# EAGLE design Nixie Clock V4 (EAGLE 9.6.2)

## Sheet 1 of 2: Control board
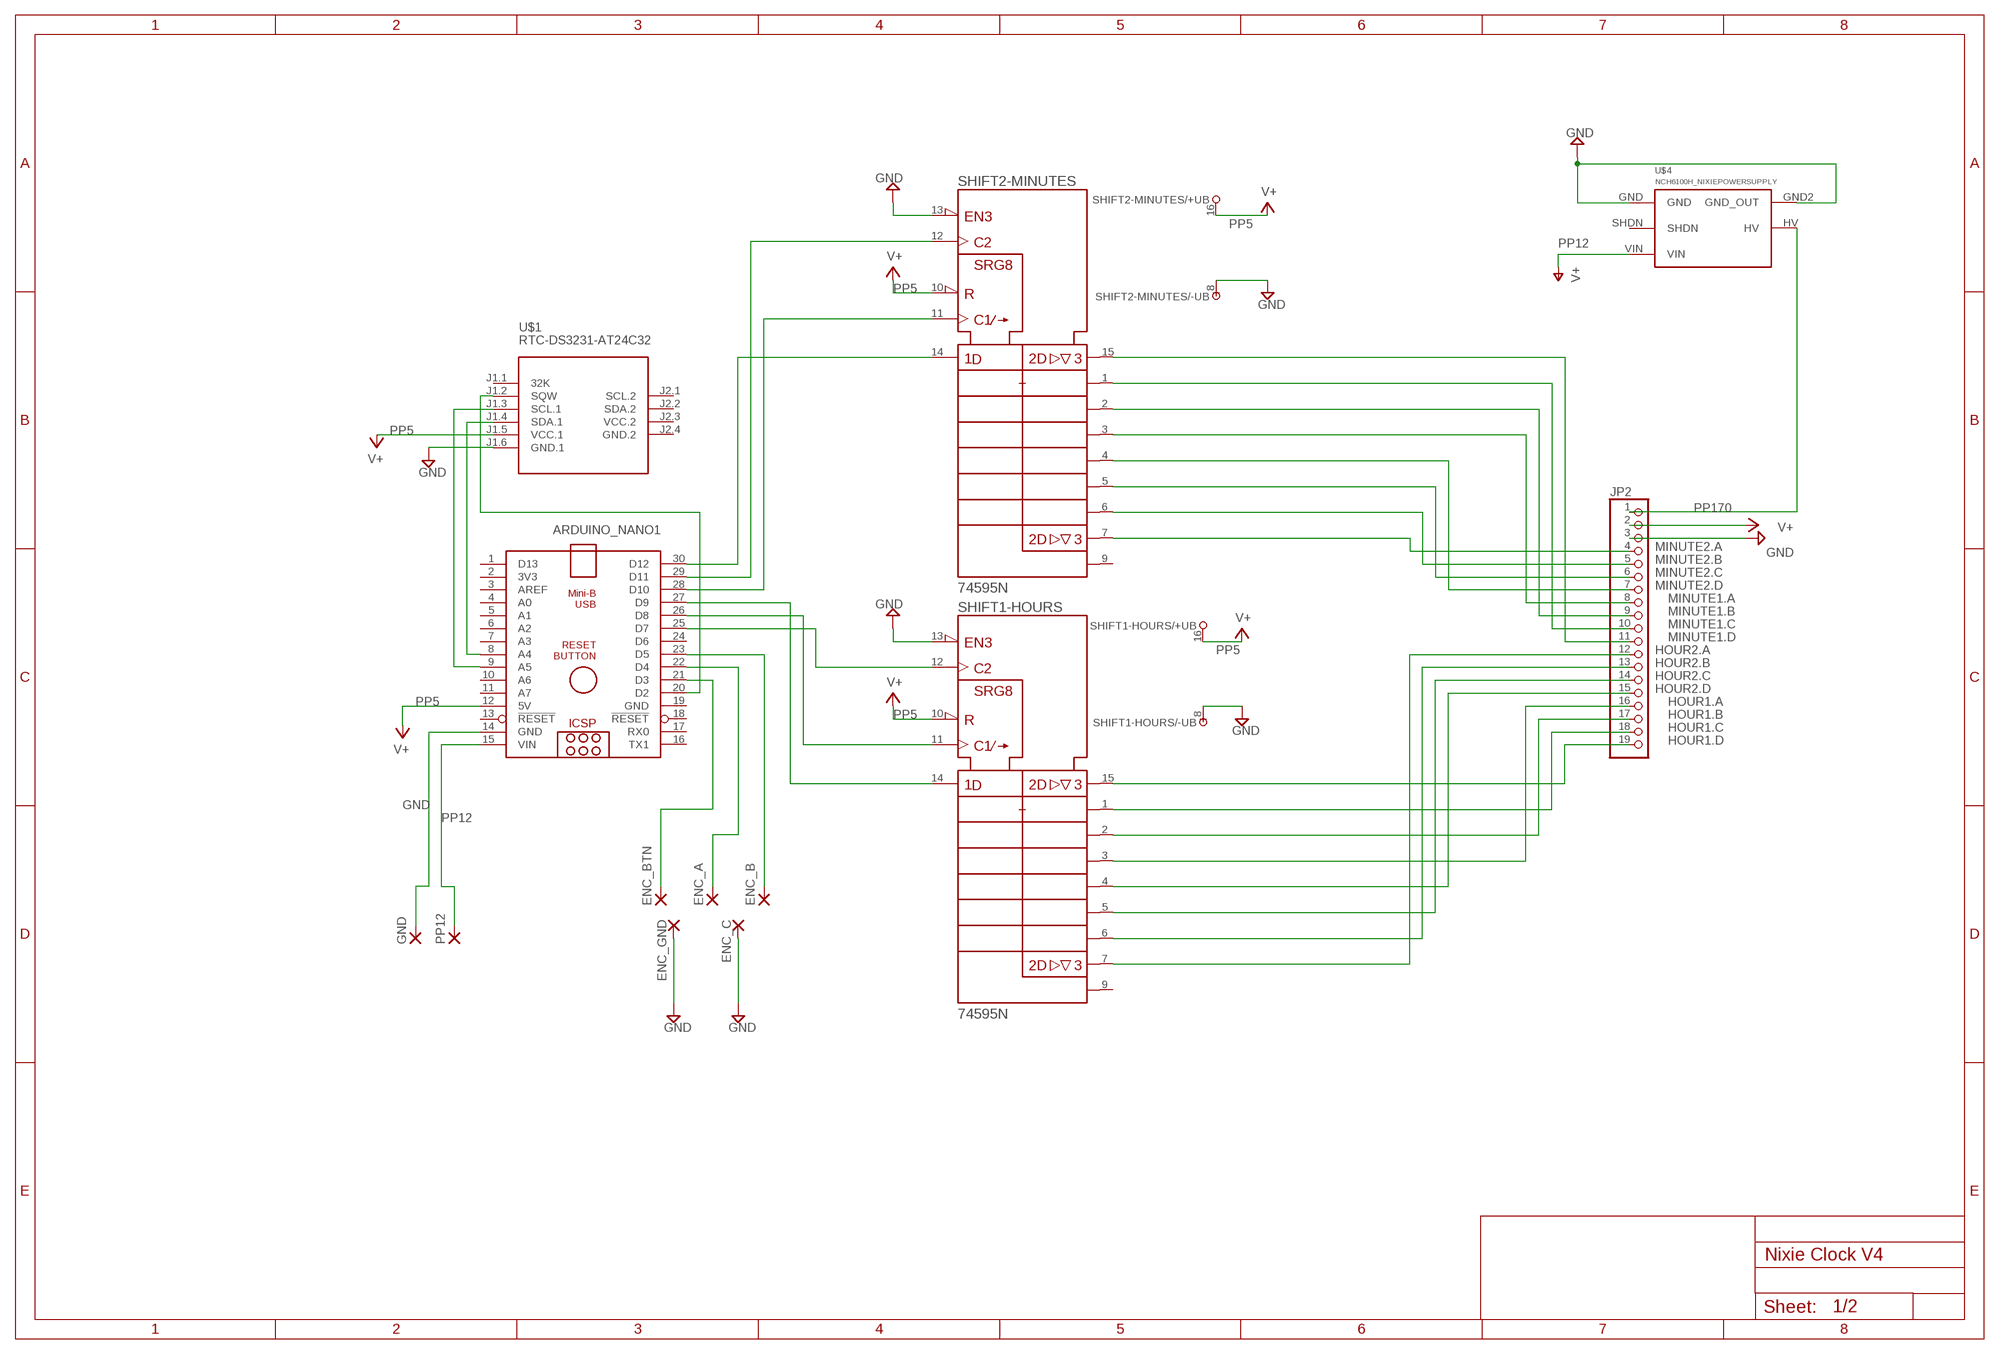
[diagram p0: schematic, sheet 1]

### Parts
ARDUINO_NANO1  ARDUINO_NANO  [ARDUINO_NANO]
ENC_A  2,54/1,0  [2,54/1,0]
ENC_B  2,54/1,0  [2,54/1,0]
ENC_BTN  2,54/1,0  [2,54/1,0]
ENC_C  2,54/1,0  [2,54/1,0]
ENC_GND  2,54/1,0  [2,54/1,0]
GND  2,54/1,0  [2,54/1,0]
JP2  PINHD-1X19  [1X19]
PP12  2,54/1,0  [2,54/1,0]
SHIFT1-HOURS  74595N  [DIL16]
SHIFT2-MINUTES  74595N  [DIL16]
U$1  RTC-DS3231-AT24C32  [RTC-DS3231-AT24C32]
U$4  NCH6100H_NIXIEPOWERSUPPLY  [NCH6100HV_NIXIEPOWERSUPPLY]

### Nets
GND: ARDUINO_NANO1.14(GND) ENC_C.1(P) ENC_GND.1(P) GND.1(P) JP2.3 SHIFT1-HOURS.8(-UB) SHIFT1-HOURS.13(!G) SHIFT2-MINUTES.8(-UB) SHIFT2-MINUTES.13(!G) U$1.J1.6(GND.1) U$4.GND U$4.GND2(GND_OUT)
HOUR1.A: JP2.16 SHIFT1-HOURS.3(QD)
HOUR1.B: JP2.17 SHIFT1-HOURS.2(QC)
HOUR1.C: JP2.18 SHIFT1-HOURS.1(QB)
HOUR1.D: JP2.19 SHIFT1-HOURS.15(QA)
HOUR2.A: JP2.12 SHIFT1-HOURS.7(QH)
HOUR2.B: JP2.13 SHIFT1-HOURS.6(QG)
HOUR2.C: JP2.14 SHIFT1-HOURS.5(QF)
HOUR2.D: JP2.15 SHIFT1-HOURS.4(QE)
MINUTE1.A: JP2.8 SHIFT2-MINUTES.3(QD)
MINUTE1.B: JP2.9 SHIFT2-MINUTES.2(QC)
MINUTE1.C: JP2.10 SHIFT2-MINUTES.1(QB)
MINUTE1.D: JP2.11 SHIFT2-MINUTES.15(QA)
MINUTE2.A: JP2.4 SHIFT2-MINUTES.7(QH)
MINUTE2.B: JP2.5 SHIFT2-MINUTES.6(QG)
MINUTE2.C: JP2.6 SHIFT2-MINUTES.5(QF)
MINUTE2.D: JP2.7 SHIFT2-MINUTES.4(QE)
N$1: ARDUINO_NANO1.8(A4) U$1.J1.4(SDA.1)
N$2: ARDUINO_NANO1.9(A5) U$1.J1.3(SCL.1)
N$3: ARDUINO_NANO1.30(D12) SHIFT2-MINUTES.14(SER)
N$4: ARDUINO_NANO1.29(D11) SHIFT2-MINUTES.12(RCK)
N$5: ARDUINO_NANO1.28(D10) SHIFT2-MINUTES.11(SRCK)
N$6: ARDUINO_NANO1.22(D4) ENC_A.1(P)
N$7: ARDUINO_NANO1.26(D8) SHIFT1-HOURS.11(SRCK)
N$8: ARDUINO_NANO1.25(D7) SHIFT1-HOURS.12(RCK)
N$26: ARDUINO_NANO1.23(D5) ENC_B.1(P)
N$27: ARDUINO_NANO1.21(D3) ENC_BTN.1(P)
N$63: ARDUINO_NANO1.20(D2) U$1.J1.2(SQW)
PP5: ARDUINO_NANO1.12(5V) JP2.2 SHIFT1-HOURS.10(!SRCLR) SHIFT1-HOURS.16(+UB) SHIFT2-MINUTES.10(!SRCLR) SHIFT2-MINUTES.16(+UB) U$1.J1.5(VCC.1) ; supply symbol labelled V+
PP12: ARDUINO_NANO1.15(VIN) PP12.1(P) U$4.VIN ; supply symbol labelled V+
PP170: JP2.1 U$4.HV
SERIAL-IN: ARDUINO_NANO1.27(D9) SHIFT1-HOURS.14(SER)
Unconnected: ARDUINO_NANO1.1(D13) ARDUINO_NANO1.2(3V3) ARDUINO_NANO1.3(AREF) ARDUINO_NANO1.4(A0) ARDUINO_NANO1.5(A1) ARDUINO_NANO1.6(A2) ARDUINO_NANO1.7(A3) ARDUINO_NANO1.10(A6) ARDUINO_NANO1.11(A7) ARDUINO_NANO1.13(!RESET) ARDUINO_NANO1.16(TX1) ARDUINO_NANO1.17(RX0) ARDUINO_NANO1.18(!RESET) ARDUINO_NANO1.24(D6) SHIFT1-HOURS.9(QH*) SHIFT2-MINUTES.9(QH*) U$1.J1.1(32K) U$1.J2.1(SCL.2) U$1.J2.2(SDA.2) U$4.SHDN

## Sheet 2 of 2: Display board
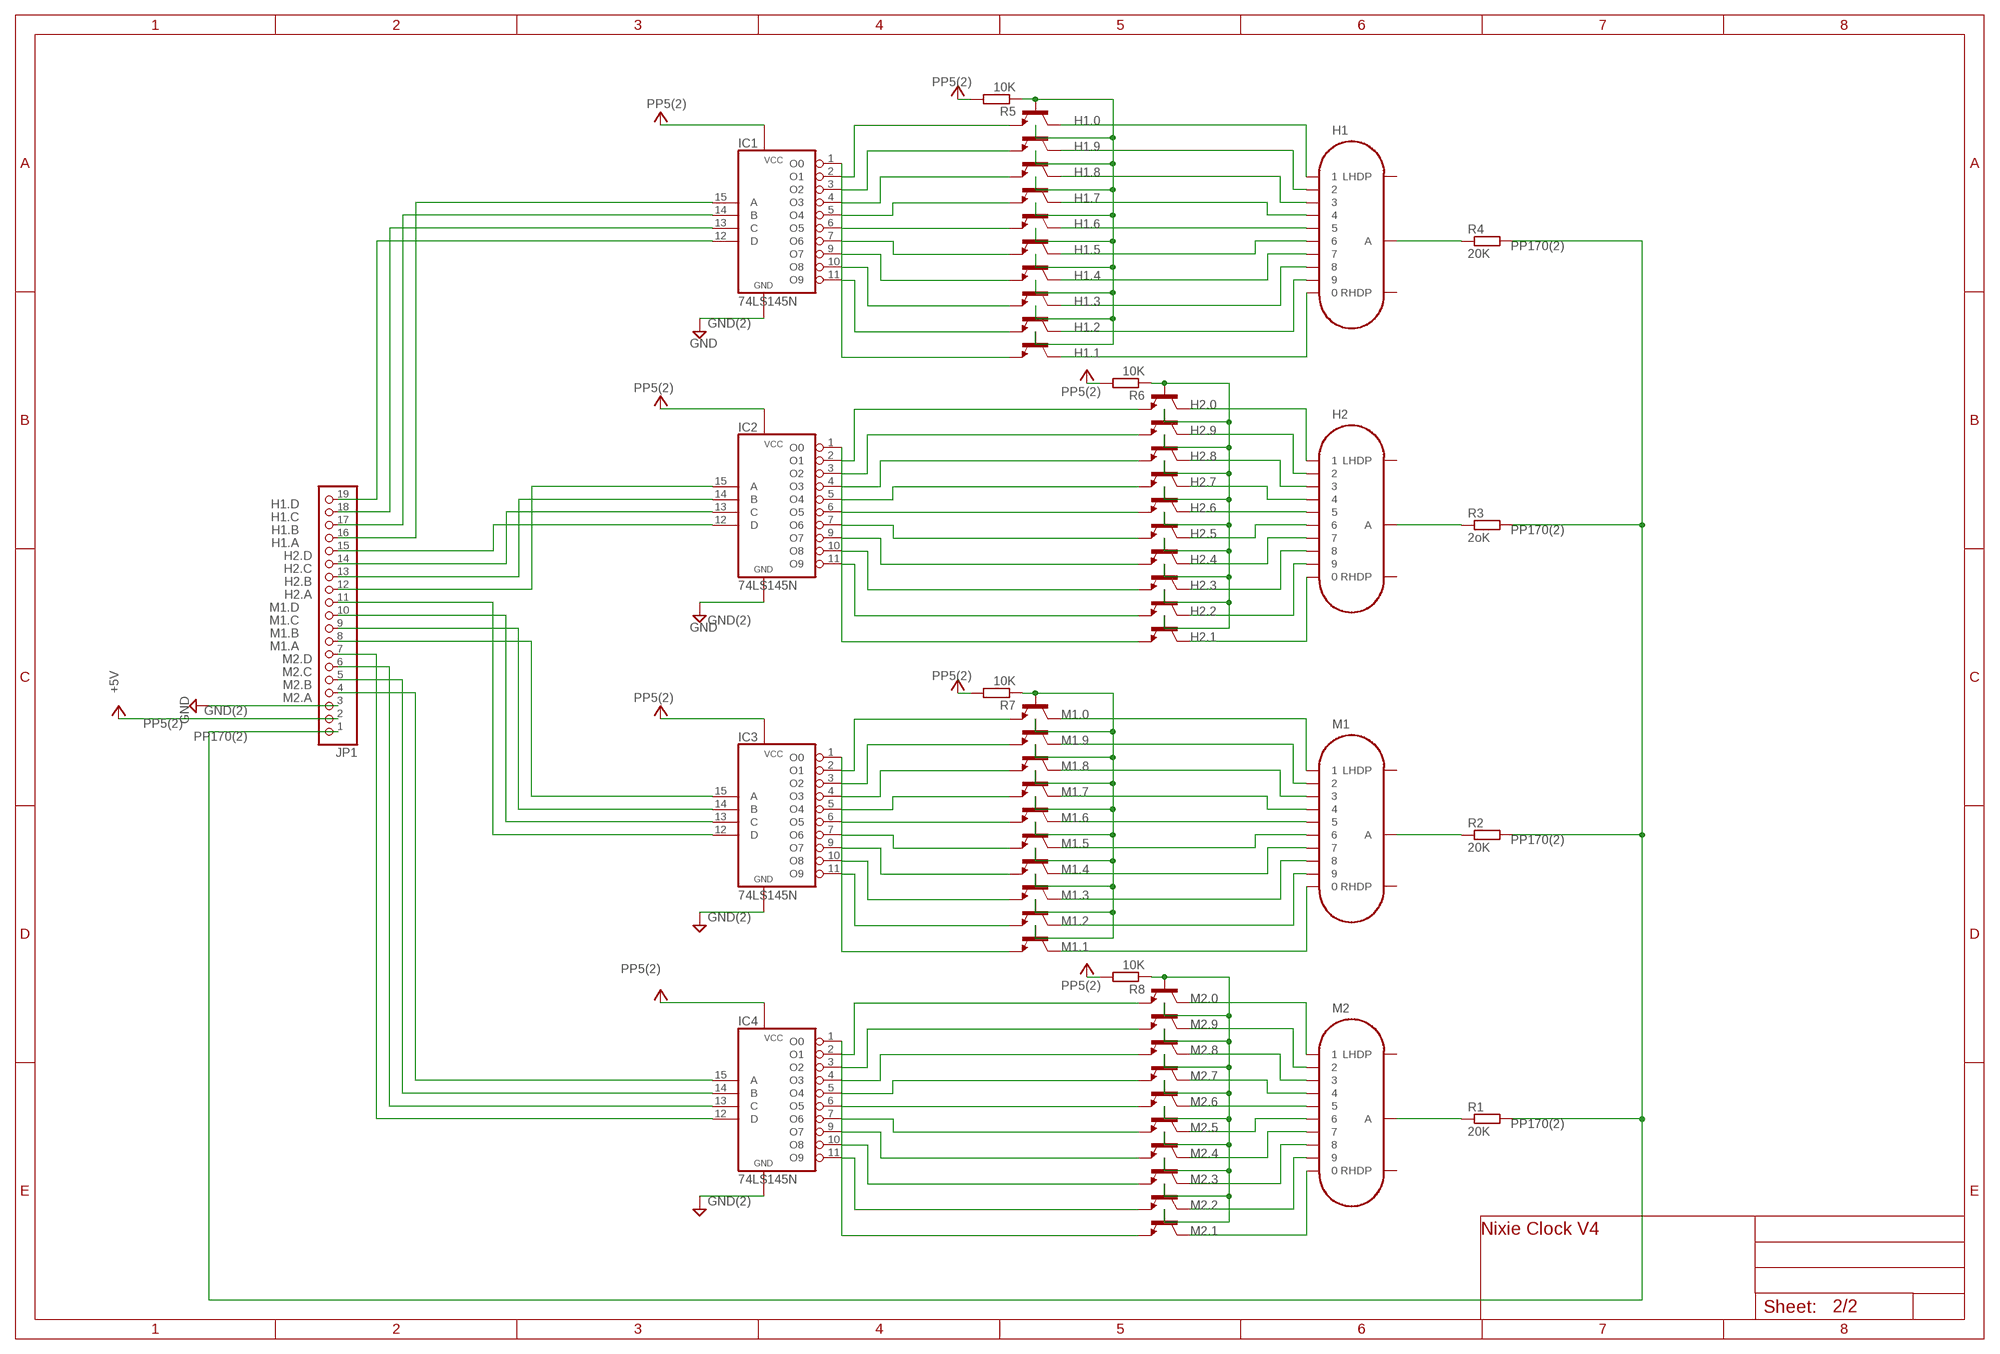
[diagram p1: schematic, sheet 2]

### Parts
H1  IN-14  [IN-14]
H1.0  MPSA42-NPN-TO92-EBC  [TO92-EBC]
H1.1  MPSA42-NPN-TO92-EBC  [TO92-EBC]
H1.2  MPSA42-NPN-TO92-EBC  [TO92-EBC]
H1.3  MPSA42-NPN-TO92-EBC  [TO92-EBC]
H1.4  MPSA42-NPN-TO92-EBC  [TO92-EBC]
H1.5  MPSA42-NPN-TO92-EBC  [TO92-EBC]
H1.6  MPSA42-NPN-TO92-EBC  [TO92-EBC]
H1.7  MPSA42-NPN-TO92-EBC  [TO92-EBC]
H1.8  MPSA42-NPN-TO92-EBC  [TO92-EBC]
H1.9  MPSA42-NPN-TO92-EBC  [TO92-EBC]
H2  IN-14  [IN-14]
H2.0  MPSA42-NPN-TO92-EBC  [TO92-EBC]
H2.1  MPSA42-NPN-TO92-EBC  [TO92-EBC]
H2.2  MPSA42-NPN-TO92-EBC  [TO92-EBC]
H2.3  MPSA42-NPN-TO92-EBC  [TO92-EBC]
H2.4  MPSA42-NPN-TO92-EBC  [TO92-EBC]
H2.5  MPSA42-NPN-TO92-EBC  [TO92-EBC]
H2.6  MPSA42-NPN-TO92-EBC  [TO92-EBC]
H2.7  MPSA42-NPN-TO92-EBC  [TO92-EBC]
H2.8  MPSA42-NPN-TO92-EBC  [TO92-EBC]
H2.9  MPSA42-NPN-TO92-EBC  [TO92-EBC]
IC1  74LS145N  [DIL16]
IC2  74LS145N  [DIL16]
IC3  74LS145N  [DIL16]
IC4  74LS145N  [DIL16]
JP1  PINHD-1X19  [1X19]
M1  IN-14  [IN-14]
M1.0  MPSA42-NPN-TO92-EBC  [TO92-EBC]
M1.1  MPSA42-NPN-TO92-EBC  [TO92-EBC]
M1.2  MPSA42-NPN-TO92-EBC  [TO92-EBC]
M1.3  MPSA42-NPN-TO92-EBC  [TO92-EBC]
M1.4  MPSA42-NPN-TO92-EBC  [TO92-EBC]
M1.5  MPSA42-NPN-TO92-EBC  [TO92-EBC]
M1.6  MPSA42-NPN-TO92-EBC  [TO92-EBC]
M1.7  MPSA42-NPN-TO92-EBC  [TO92-EBC]
M1.8  MPSA42-NPN-TO92-EBC  [TO92-EBC]
M1.9  MPSA42-NPN-TO92-EBC  [TO92-EBC]
M2  IN-14  [IN-14]
M2.0  MPSA42-NPN-TO92-EBC  [TO92-EBC]
M2.1  MPSA42-NPN-TO92-EBC  [TO92-EBC]
M2.2  MPSA42-NPN-TO92-EBC  [TO92-EBC]
M2.3  MPSA42-NPN-TO92-EBC  [TO92-EBC]
M2.4  MPSA42-NPN-TO92-EBC  [TO92-EBC]
M2.5  MPSA42-NPN-TO92-EBC  [TO92-EBC]
M2.6  MPSA42-NPN-TO92-EBC  [TO92-EBC]
M2.7  MPSA42-NPN-TO92-EBC  [TO92-EBC]
M2.8  MPSA42-NPN-TO92-EBC  [TO92-EBC]
M2.9  MPSA42-NPN-TO92-EBC  [TO92-EBC]
R1  20K  R-EU_0411/12  [0411/12]
R2  20K  R-EU_0411/12  [0411/12]
R3  2oK  R-EU_0411/12  [0411/12]
R4  20K  R-EU_0411/12  [0411/12]
R5  10K  R-EU_0411/12  [0411/12]
R6  10K  R-EU_0411/12  [0411/12]
R7  10K  R-EU_0411/12  [0411/12]
R8  10K  R-EU_0411/12  [0411/12]

### Nets
GND(2): IC1.8(GND) IC2.8(GND) IC3.8(GND) IC4.8(GND) JP1.3 ; supply symbol labelled GND
H1.A: IC1.15(A) JP1.16
H1.B: IC1.14(B) JP1.17
H1.C: IC1.13(C) JP1.18
H1.D: IC1.12(D) JP1.19
H2.A: IC2.15(A) JP1.12
H2.B: IC2.14(B) JP1.13
H2.C: IC2.13(C) JP1.14
H2.D: IC2.12(D) JP1.15
M1.4: M1.0.B M1.1.B M1.2.B M1.3.B M1.4.B M1.5.B M1.6.B M1.7.B M1.8.B M1.9.B R7.1
M1.A: IC3.15(A) JP1.8
M1.B: IC3.14(B) JP1.9
M1.C: IC3.13(C) JP1.10
M1.D: IC3.12(D) JP1.11
M2.4: M2.0.B M2.1.B M2.2.B M2.3.B M2.4.B M2.5.B M2.6.B M2.7.B M2.8.B M2.9.B R8.1
M2.A: IC4.15(A) JP1.4
M2.B: IC4.14(B) JP1.5
M2.C: IC4.13(C) JP1.6
M2.D: IC4.12(D) JP1.7
N$9: H1.0.B H1.1.B H1.2.B H1.3.B H1.4.B H1.5.B H1.6.B H1.7.B H1.8.B H1.9.B R5.1
N$10: H2.0.B H2.1.B H2.2.B H2.3.B H2.4.B H2.5.B H2.6.B H2.7.B H2.8.B H2.9.B R6.1
N$11: M2.0.C M2.1
N$12: M2.2 M2.9.C
N$13: M2.3 M2.8.C
N$18: M2.4 M2.7.C
N$19: M2.0 M2.1.C
N$20: M2.2.C M2.9
N$21: M2.3.C M2.8
N$22: M2.4.C M2.7
N$23: M2.5.C M2.6
N$24: M2.5 M2.6.C
N$25: M1.5 M1.6.C
N$28: M1.0.C M1.1
N$29: M1.2 M1.9.C
N$30: M1.3 M1.8.C
N$31: M1.4 M1.7.C
N$32: M1.0 M1.1.C
N$33: M1.2.C M1.9
N$34: M1.3.C M1.8
N$35: M1.4.C M1.7
N$36: M1.5.C M1.6
N$37: H2.0 H2.1.C
N$38: H2.2.C H2.9
N$39: H2.3.C H2.8
N$40: H2.0.C H2.1
N$41: H2.2 H2.9.C
N$42: H2.3 H2.8.C
N$43: H2.4.C H2.7
N$44: H2.5.C H2.6
N$45: H2.4 H2.7.C
N$46: H2.5 H2.6.C
N$47: H1.0.C H1.1
N$48: H1.2 H1.9.C
N$49: H1.3 H1.8.C
N$50: H1.4 H1.7.C
N$51: H1.5 H1.6.C
N$52: H1.0 H1.1.C
N$53: H1.2.C H1.9
N$54: H1.3.C H1.8
N$55: H1.4.C H1.7
N$56: H1.5.C H1.6
N$57: IC4.2(O1) M2.0.E
N$58: IC4.3(O2) M2.9.E
N$59: IC4.4(O3) M2.8.E
N$60: IC4.5(O4) M2.7.E
N$61: IC4.6(O5) M2.6.E
N$62: IC4.7(O6) M2.5.E
N$64: IC4.9(O7) M2.4.E
N$65: IC4.10(O8) M2.3.E
N$66: IC4.11(O9) M2.2.E
N$67: IC4.1(O0) M2.1.E
N$68: IC3.6(O5) M1.6.E
N$69: H1.6.E IC1.6(O5)
N$70: H2.6.E IC2.6(O5)
N$71: M2.A R1.1
N$72: M1.A R2.1
N$73: H2.A R3.1
N$74: H1.A R4.1
N$75: IC3.2(O1) M1.0.E
N$76: IC3.3(O2) M1.9.E
N$77: IC3.4(O3) M1.8.E
N$78: IC3.5(O4) M1.7.E
N$79: IC3.7(O6) M1.5.E
N$80: IC3.9(O7) M1.4.E
N$81: IC3.10(O8) M1.3.E
N$82: IC3.11(O9) M1.2.E
N$83: IC3.1(O0) M1.1.E
N$84: H2.0.E IC2.2(O1)
N$85: H2.9.E IC2.3(O2)
N$86: H2.8.E IC2.4(O3)
N$87: H2.7.E IC2.5(O4)
N$88: H2.5.E IC2.7(O6)
N$89: H2.4.E IC2.9(O7)
N$90: H2.3.E IC2.10(O8)
N$91: H2.2.E IC2.11(O9)
N$92: H2.1.E IC2.1(O0)
N$93: H1.0.E IC1.2(O1)
N$94: H1.9.E IC1.3(O2)
N$95: H1.8.E IC1.4(O3)
N$96: H1.7.E IC1.5(O4)
N$97: H1.5.E IC1.7(O6)
N$98: H1.4.E IC1.9(O7)
N$99: H1.3.E IC1.10(O8)
N$100: H1.2.E IC1.11(O9)
N$101: H1.1.E IC1.1(O0)
PP5(2): IC1.16(VCC) IC2.16(VCC) IC3.16(VCC) IC4.16(VCC) JP1.2 R5.2 R6.2 R7.2 R8.2 ; supply symbol labelled +5V
PP170(2): JP1.1 R1.2 R2.2 R3.2 R4.2
Unconnected: H1.LHDP H1.RHDP H2.LHDP H2.RHDP M1.LHDP M1.RHDP M2.LHDP M2.RHDP

## Power pins joined to a net without a drawn wire
GND: ARDUINO_NANO1.19(GND)
GND.2: U$1.J2.4(GND.2)
VCC.2: U$1.J2.3(VCC.2)

## Library data of the parts
ARDUINO_NANO1 = ArduinoNanoV30:ARDUINO_NANO: Arduino Nano V3.0 Overview: The Arduino Nano is a small, complete, and breadboard-friendly board based on the ATmega328 (Arduino Nano 3.x) or ATmega168 (Arduino Nano 2.x). It has more or less the same functionality of the Arduino Duemilanove, but in a different package. It lacks only a DC power jack, and works with a Mini-B USB cable instead of a standard one. The Nano was designed and is being produced by Gravitech. Specifications: Microcontroller Atmel ATmega168 or ATmega328 Operating Voltage (logic level) 5 V Input Voltage (recommended) 7-12 V Input Voltage (limits) 6-20 V Digital I/O Pins 14 (of which 6 provide PWM output) Analog Input Pins 8 DC Current per I/O Pin 40 mA Flash Memory 16 KB (ATmega168) or 32 KB (ATmega328) of which 2 KB used by bootloader SRAM 1 KB (ATmega168) or 2 KB (ATmega328) EEPROM 512 bytes (ATmega168) or 1 KB (ATmega328) Clock Speed 16 MHz Dimensions 0.73" x 1.70" Length 45 mm Width 18 mm Weigth 5 g Power: The Arduino Nano can be powered via the Mini-B USB connection, 6-20V unregulated external power supply (pin 30), or 5V regulated external power supply (pin 27). The power source is automatically selected to the highest voltage source. Memory: The ATmega168 has 16 KB of flash memory for storing code (of which 2 KB is used for the bootloader); the ATmega328 has 32 KB, (also with 2 KB used for the bootloader). The ATmega168 has 1 KB of SRAM and 512 bytes of EEPROM (which can be read and written with the EEPROM library); the ATmega328 has 2 KB of SRAM and 1 KB of EEPROM. Input and Output: Each of the 14 digital pins on the Nano can be used as an input or output, using pinMode(), digitalWrite(), and digitalRead() functions. They operate at 5 volts. Each pin can provide or receive a maximum of 40 mA and has an internal pull-up resistor (disconnected by default) of 20-50 kOhms. In addition, some pins have specialized functions. Visit Arduino - ArduinoBoardNano <https://www.arduino.cc/en/Main/ArduinoBoardNano>
ENC_A ENC_B ENC_BTN ENC_C ENC_GND GND PP12 = wirepad:2,54/1,0: THROUGH-HOLE PAD
H1 H2 M1 M2 = russian-nixies:IN-14: IN-14: medium numeric frontview nixie tube
H1.0 H1.1-H1.9 H2.0 H2.1-H2.9 M1.0 M1.1-M1.9 M2.0 M2.1-M2.9 = Joel Custom library:*-NPN-: NPN Transistror BF959 corrected 2008.03.06
IC1-IC4 = Joel Custom library:74*145: BCD to decimal DECODER/DRIVER
JP1 JP2 = pinhead:PINHD-1X19: PIN HEADER
R1-R8 = rcl:R-EU_: RESISTOR, European symbol; SPICEPREFIX: R
SHIFT1-HOURS SHIFT2-MINUTES = 74ttl-din:74*595: 8-bit SHIFT REGISTER, output latch
U$1 = diy-modules (1):RTC-DS3231-AT24C32: RTC Module with Battery and EEPROM based on DS3231 and AT24C32 chips Tutorial can be found here: https://edwardmallon.wordpress.com/2014/05/21/using-a-cheap-3-ds3231-rtc-at24c32-eeprom-from-ebay/ Click here to find device on ebay.com <http://www.ebay.com/sch/DS3231+AT24C32+module>
U$4 = Joel Custom library:NCH6100H_NIXIEPOWERSUPPLY

## Board
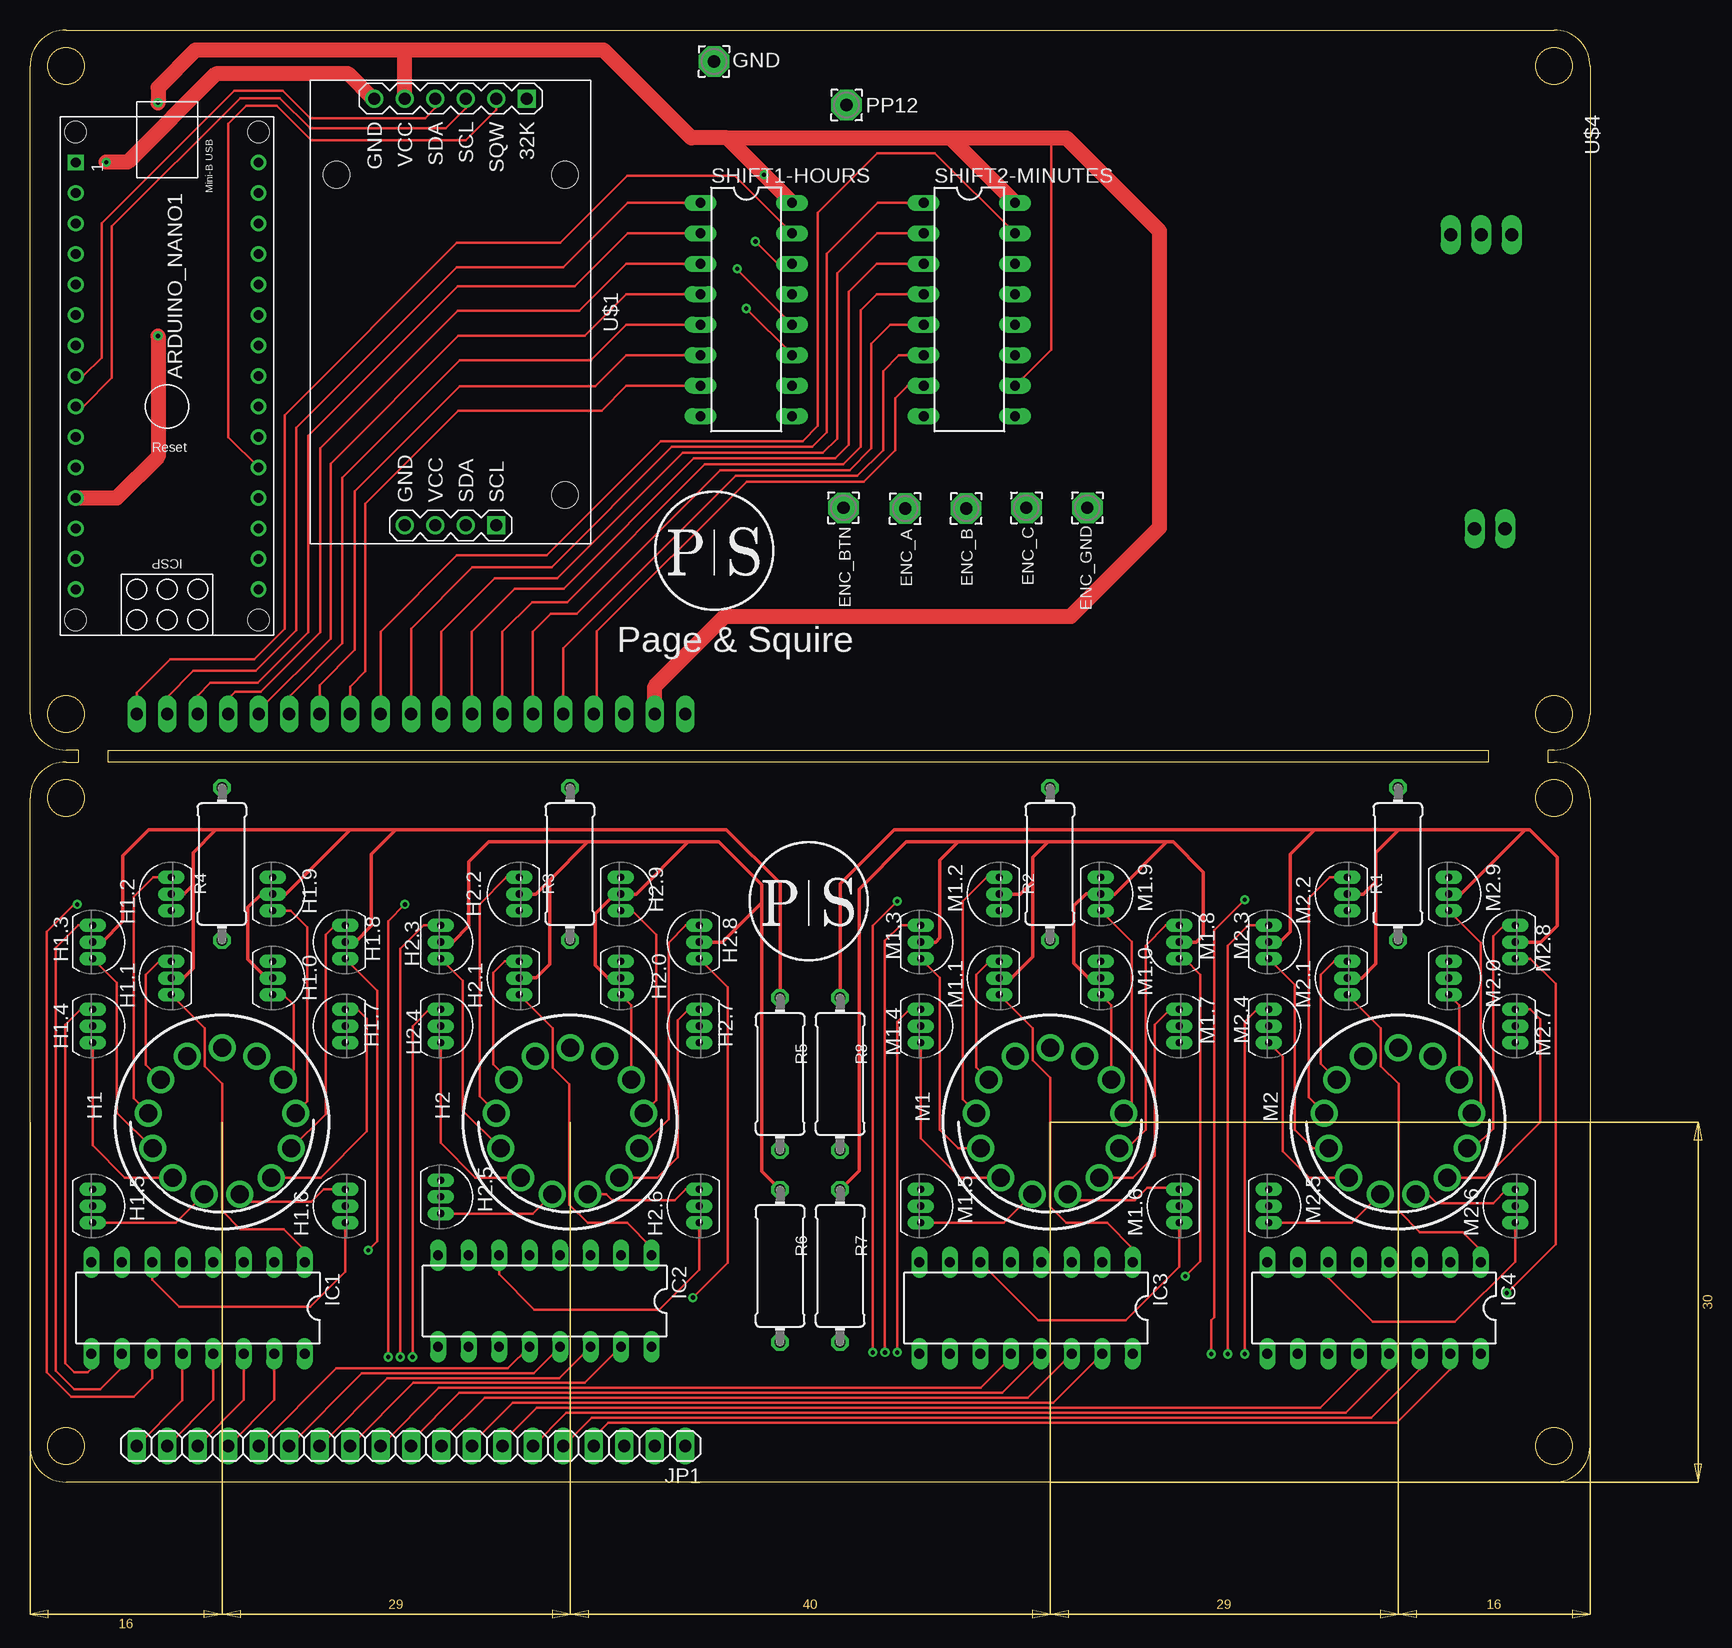
[diagram p2: board, top side]
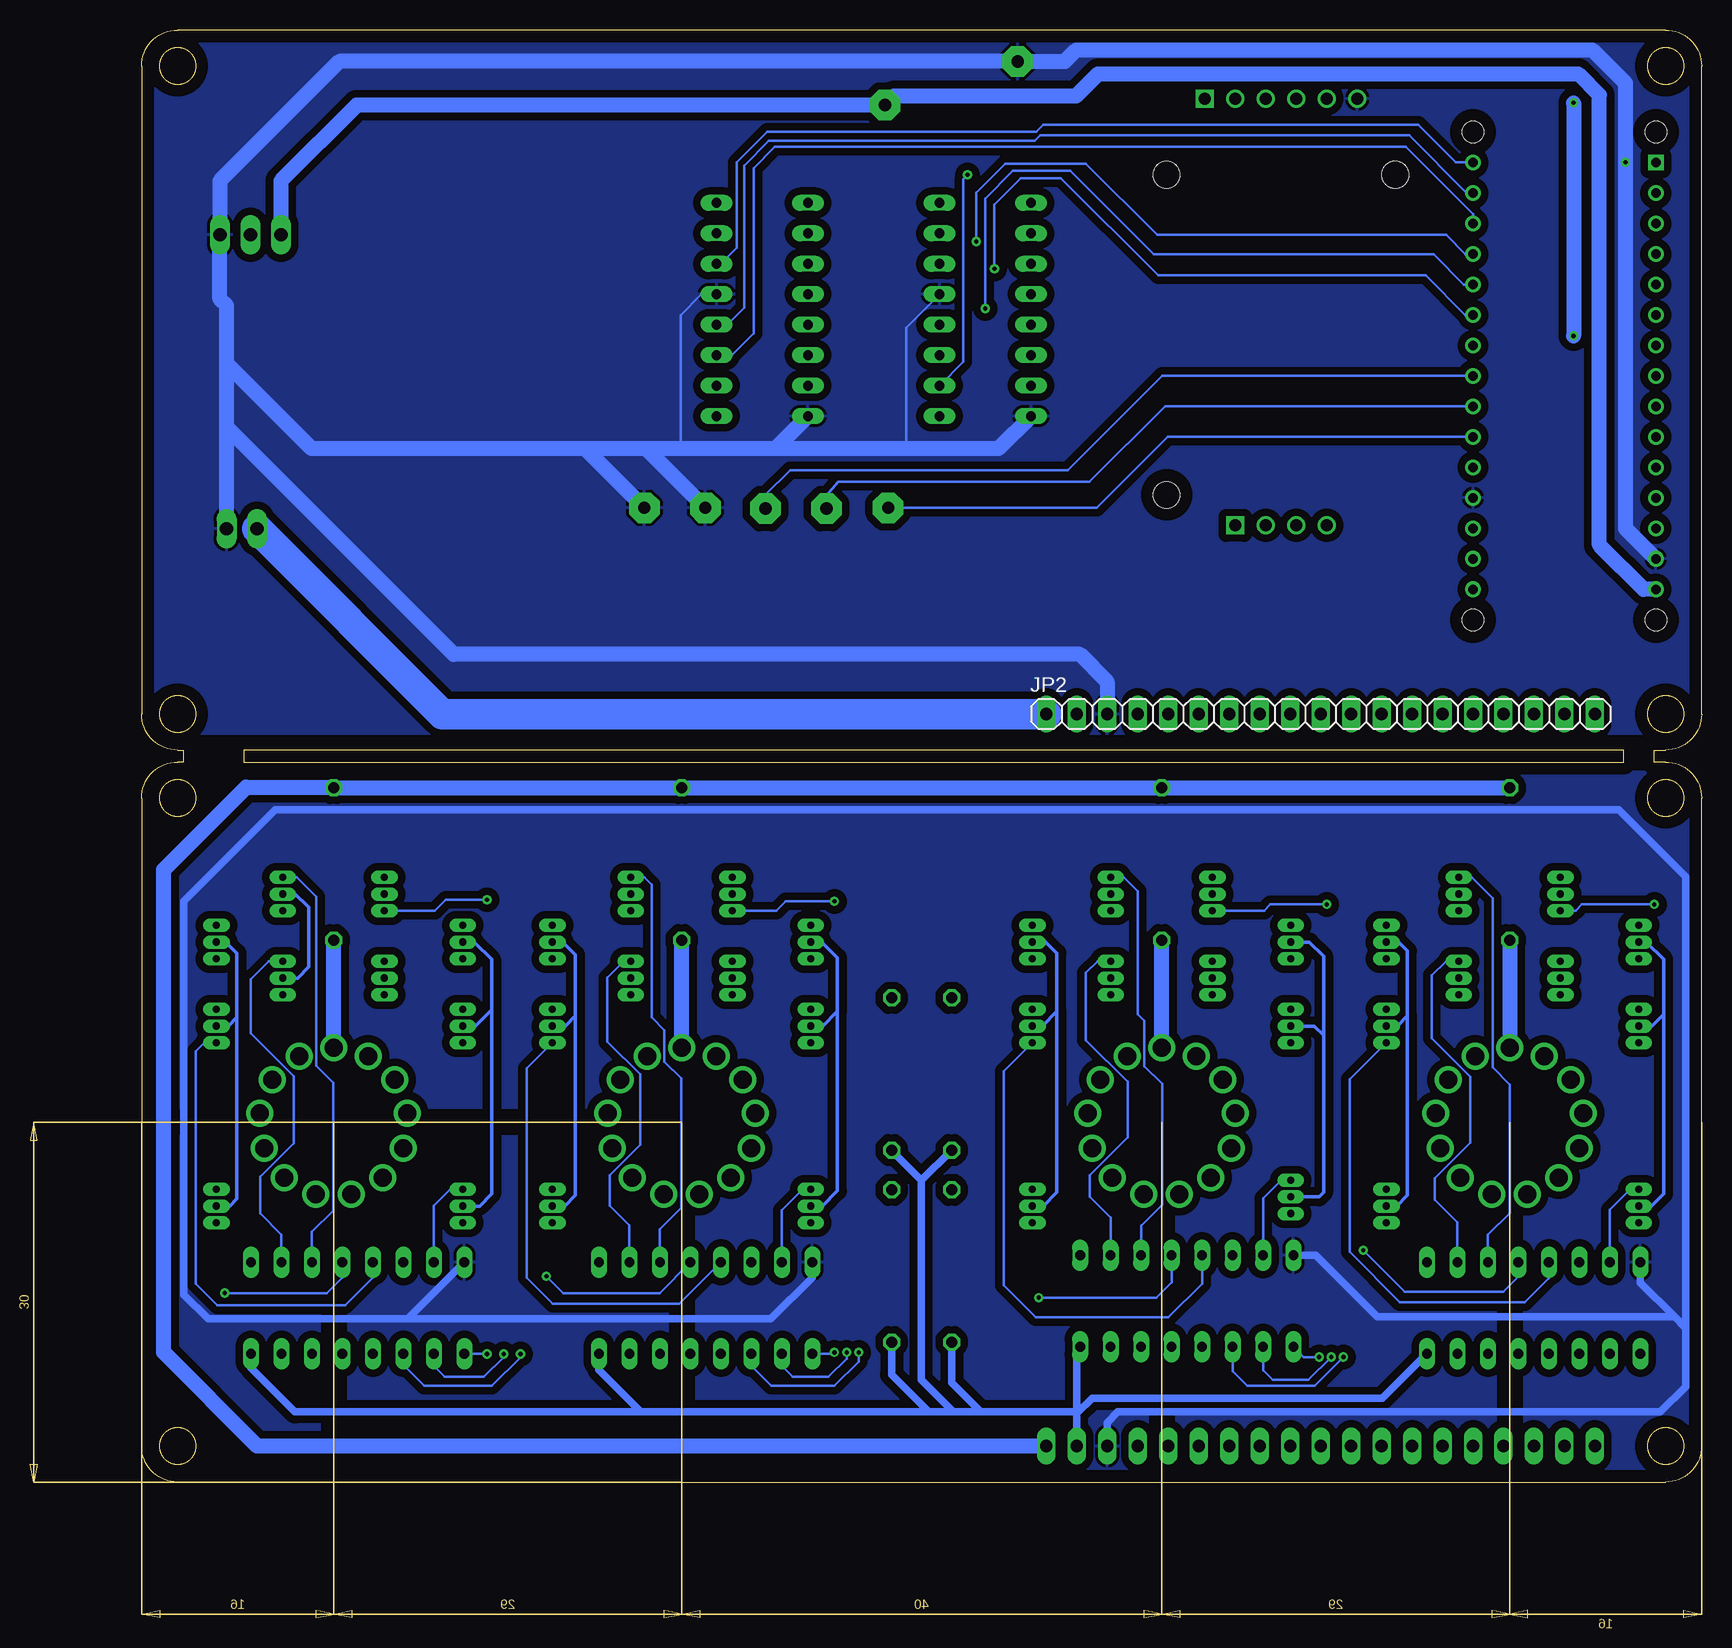
[diagram p3: board, bottom side, seen from below]

Size 130 x 121 mm. Coordinates in mm from the lower left corner, seen from the top.
Outline: 6.5,61 121.5,61 121.5,60 6.5,60 6.5,61
Outline: 130,118 arc90 127,121 3,121 arc90 0,118 0,64 arc90 3,61 4,61 4,60 3,60 arc90 0,57 0,3 arc90 3,0 127,0 arc90 130,3 130,57 arc90 127,60 126.5,60 126.5,61 127,61 arc90 130,64 130,118
Outline: circle at 3,64 radius 1.5
Outline: circle at 127,57 radius 1.5
Outline: circle at 127,118 radius 1.5
Outline: circle at 127,64 radius 1.5
Outline: circle at 127,3 radius 1.5
Outline: circle at 3,118 radius 1.5
Outline: circle at 3,3 radius 1.5
Outline: circle at 3,57 radius 1.5
Copper layers (1*16): Top 0.035mm / dielectric 1.5mm / Bottom 0.035mm
Design rules "JLCPCD 2layer *": minimum track width 6mil, minimum drill 0.35mm, track to track 8mil, track to pad 8mil, pad to pad 8mil, via to via 8mil, smd to smd 6mil, copper to edge 40mil, drill to drill 8mil, minimum pad ring 10mil, minimum via ring 8mil, stop-mask expansion 4mil, vias tented up to drill 0mil, thermal gap 10mil

### Footprints (pad centres in the part's own frame; a part is rotated, then mirrored left to right if it is on the bottom)
ARDUINO_NANO = drill 0.8 square: 1 -20.32,-7.62 | drill 0.8: 2 -17.78,-7.62; 3 -15.24,-7.62; 4 -12.7,-7.62; 5 -10.16,-7.62; 6 -7.62,-7.62; 7 -5.08,-7.62; 8 -2.54,-7.62; 9 0,-7.62; 10 2.54,-7.62; 11 5.08,-7.62; 12 7.62,-7.62; 13 10.16,-7.62; 14 12.7,-7.62; 15 15.24,-7.62; 16 15.24,7.62; 17 12.7,7.62; 18 10.16,7.62; 19 7.62,7.62; 20 5.08,7.62; 21 2.54,7.62; 22 0,7.62; 23 -2.54,7.62; 24 -5.08,7.62; 25 -7.62,7.62; 26 -10.16,7.62; 27 -12.7,7.62; 28 -15.24,7.62; 29 -17.78,7.62; 30 -20.32,7.62 | hole 1.778: -22.86,-7.62; -22.86,7.62; 17.78,7.62; 17.78,-7.62
2,54/1,0 = drill 1.016 pad 2.54 octagon: 1 0,0
IN-14 = drill 1.5: 0 5.094,-3.516; 1 -5.094,-3.516; 2 -6.145,-0.746; 3 -5.788,2.195; 4 -4.105,4.633; 5 -1.481,6.01; 6 1.481,6.01; 7 4.105,4.633; 8 5.788,2.195; 9 6.145,-0.746; A 0,-6.19; LHDP 2.877,-5.481; RHDP -2.877,-5.481
TO92-EBC = drill 0.6 pad 1 long: B 0,-1.27; C 1.39,-1.27; E -1.39,-1.27
DIL16 = drill 0.813 long: 1 -8.89,-3.81; 2 -6.35,-3.81; 3 -3.81,-3.81; 4 -1.27,-3.81; 5 1.27,-3.81; 6 3.81,-3.81; 7 6.35,-3.81; 8 8.89,-3.81; 9 8.89,3.81; 10 6.35,3.81; 11 3.81,3.81; 12 1.27,3.81; 13 -1.27,3.81; 14 -3.81,3.81; 15 -6.35,3.81; 16 -8.89,3.81
1X19 = drill 1.016 long: 1 -22.86,0; 2 -20.32,0; 3 -17.78,0; 4 -15.24,0; 5 -12.7,0; 6 -10.16,0; 7 -7.62,0; 8 -5.08,0; 9 -2.54,0; 10 0,0; 11 2.54,0; 12 5.08,0; 13 7.62,0; 14 10.16,0; 15 12.7,0; 16 15.24,0; 17 17.78,0; 18 20.32,0; 19 22.86,0
0411/12 = drill 0.914 octagon: 1 -6.35,0; 2 6.35,0
RTC-DS3231-AT24C32 = drill 1 square: J1.1 -17.78,6.35; J2.1 17.78,3.81 | drill 1: J1.2 -17.78,3.81; J1.3 -17.78,1.27; J1.4 -17.78,-1.27; J1.5 -17.78,-3.81; J1.6 -17.78,-6.35; J2.2 17.78,1.27; J2.3 17.78,-1.27; J2.4 17.78,-3.81 | hole 2.2: -11.43,-9.525; -11.43,9.525; 15.24,9.525
NCH6100HV_NIXIEPOWERSUPPLY = drill 1.1 long: GND -12.5,14.25; GND2 12,13.7; HV 12,11.16; SHDN -12.5,11.71; VIN -12.5,9.17

### Placement (x,y rotation side)
ARDUINO_NANO1  11.43,89.63 270 top
ENC_A  72.93,81.12 0 top
ENC_B  78.01,81.12 180 top
ENC_BTN  67.79,81.18 180 top
ENC_C  83.03,81.18 0 top
ENC_GND  88.11,81.18 180 top
GND  57,118.38 0 top
H1  16,30 180 top
H1.0  21.5,42 270 top
H1.1  10.5,42 90 top
H1.2  10.5,49 90 top
H1.3  6.5,45 270 top
H1.4  6.5,38 270 top
H1.5  6.5,23 270 top
H1.6  25,23 90 top
H1.7  25,38 90 top
H1.8  25,45 90 top
H1.9  21.5,49 270 top
H2  45,30 180 top
H2.0  50.5,42 270 top
H2.1  39.5,42 90 top
H2.2  39.5,49 90 top
H2.3  35.5,45 270 top
H2.4  35.5,38 270 top
H2.5  35.5,23.76 270 top
H2.6  54.5,23 90 top
H2.7  54.5,38 90 top
H2.8  54.5,45 90 top
H2.9  50.5,49 270 top
IC1  14,14.5 180 top
IC2  42.9,15.08 180 top
IC3  83,14.5 180 top
IC4  112,14.5 180 top
JP1  31.75,3 180 top
JP2  31.75,64 0 bottom
M1  85,30 180 top
M1.0  90.5,42 270 top
M1.1  79.5,42 90 top
M1.2  79.5,49 90 top
M1.3  75.5,45 270 top
M1.4  75.5,38 270 top
M1.5  75.5,23 270 top
M1.6  94.5,23 90 top
M1.7  94.5,38 90 top
M1.8  94.5,45 90 top
M1.9  90.5,49 270 top
M2  114,30 180 top
M2.0  119.5,42 270 top
M2.1  108.5,42 90 top
M2.2  108.5,49 90 top
M2.3  104.5,45 270 top
M2.4  104.5,38 270 top
M2.5  104.5,23 270 top
M2.6  122.5,23 90 top
M2.7  122.5,38 90 top
M2.8  122.5,45 90 top
M2.9  119.5,49 270 top
PP12  68.05,114.75 180 top
R1  114,51.5 90 top
R2  85,51.5 90 top
R3  45,51.5 90 top
R4  16,51.5 90 top
R5  62.5,34 270 top
R6  62.5,18 270 top
R7  67.5,18 270 top
R8  67.5,34 270 top
SHIFT1-HOURS  59.69,97.71 270 top
SHIFT2-MINUTES  78.28,97.71 270 top
U$1  35.05,97.5 270 top
U$4  109.22,91.44 270 top

### Tracks (layer width: path | path; a pad name or v marks a point on that pad's centre or on a via)
GND  (via drill 0.35)
  Top 1.27: U$1.J1.6 28.61,115.28 26.54,117.35 15.49,117.35 8.13,109.98 v6.35,109.98
  Bottom 0.203: SHIFT2-MINUTES.13 83.36,98.98 85.09,97.25 85.09,86.11 | SHIFT1-HOURS.13 66.29,96.19 66.29,86.11
  Bottom 1.27: ARDUINO_NANO1.14 6.35,79.47 v6.35,109.98 6.35,116.59 9.11,119.35 52.1,119.35 53.07,118.38 GND.1 113.52,118.38 123.47,108.43 U$4.GND 123.47,98.58 122.92,98.03 122.92,93.2 | JP2.3 49.53,66.7 51.79,68.96 104,68.96 122.92,87.88 | SHIFT1-HOURS.8 58.59,86.11 66.29,86.11 77.18,86.11 | 77.18,86.11 85.09,86.11 87.95,86.11 | 87.95,86.11 93.03,86.11 | 93.03,86.11 115.82,86.11 122.92,93.2 | SHIFT2-MINUTES.8 77.18,86.11 | ENC_GND.1 93.03,86.11 | ENC_C.1 87.95,86.11 | U$4.GND2 122.92,87.88 | 122.92,87.88 122.92,93.2
  pour Bottom (isolate 0.635): 0.13,120.9 0.13,62.36 130.3,62.36 130.3,120.9
GND(2)
  Bottom 0.635: JP1.3 49.53,4.95 48.64,5.84 3.43,5.84 1.33,7.94 1.33,12.83 | 1.33,12.83 1.33,50.42 6.92,56.01 118.87,56.01 126.49,48.39 126.49,15.62 124.46,13.59 107.83,13.59 | IC3.8 74.11,17.04 77.56,13.59 107.83,13.59 | IC1.8 5.11,16.6 2.26,13.75 | 2.26,13.75 1.33,12.83 | IC2.8 32.15,18.89 27.01,13.75 2.26,13.75 | IC4.8 107.83,13.59
  pour Bottom (isolate 0.635): -2.29,58.67 -2.29,2.03 3.05,-3.3 125.48,-3.3 132.84,4.06 132.84,57.15 130.81,59.18 -1.78,59.18
H1.A
  Top 0.203: JP1.16 20.35,6.84 IC1.15
H1.B
  Top 0.203: JP1.17 17.81,6.84 IC1.14
H1.C
  Top 0.203: JP1.18 15.27,6.84 IC1.13
H1.D
  Top 0.203: JP1.19 12.7,6.81 12.7,8.16 IC1.12
H2.A
  Top 0.203: JP1.12 31.93,8.26 46.23,8.26 IC2.15
H2.B
  Top 0.203: JP1.13 29.79,8.66 44.1,8.66 IC2.14
H2.C
  Top 0.203: JP1.14 27.66,9.07 41.96,9.07 IC2.13
H2.D
  Top 0.203: JP1.15 25.52,9.47 39.83,9.47 IC2.12
HOUR1.A
  Top 0.203: SHIFT1-HOURS.3 49.69,101.52 45.78,97.61 35.63,97.61 24.18,86.16 24.18,70.81 19.24,65.86 17.09,65.86 16.51,65.28 JP2.16
HOUR1.B
  Top 0.203: SHIFT1-HOURS.2 49.82,104.06 45.4,99.64 35.63,99.64 23.19,87.2 23.19,70.83 18.96,66.6 15.04,66.6 13.97,65.53 JP2.17
HOUR1.C
  Top 0.203: SHIFT1-HOURS.1 49.83,106.6 44.45,101.22 35.56,101.22 22.2,87.86 22.2,70.97 18.82,67.59 13.61,67.59 11.43,65.41 JP2.18
HOUR1.D
  Top 0.203: SHIFT1-HOURS.15 58.72,108.84 49.78,108.84 44.2,103.25 35.56,103.25 21.21,88.9 21.21,71.12 18.67,68.58 11.68,68.58 8.89,65.79 JP2.19
HOUR2.A
  Top 0.203: JP2.12 26.67,66.29 27.94,67.56 27.94,81.53 35.69,89.28 47.62,89.28 49.7,91.36 SHIFT1-HOURS.7
HOUR2.B
  Top 0.203: SHIFT1-HOURS.6 49.68,93.9 47.1,91.33 35.83,91.33 27.05,82.55 27.05,69.33 24.13,66.41 JP2.13
HOUR2.C
  Top 0.203: SHIFT1-HOURS.5 49.7,96.44 46.74,93.47 35.81,93.47 26.04,83.69 26.04,69.88 21.59,65.43 JP2.14
HOUR2.D
  Top 0.203: SHIFT1-HOURS.4 49.7,98.98 46.23,95.5 35.69,95.5 25.04,84.86 25.04,70.28 19.02,64.25 19.02,64.16 19.05,64.13 JP2.15
M1.4
  Top 0.305: R7.1 69.09,25.94 69.09,49.4 73.03,53.34 77.34,53.34 | 77.34,53.34 84.84,53.34 | 84.84,53.34 94.74,53.34 | 94.74,53.34 95.25,53.34 97.79,50.8 97.79,45.59 97.2,45 M1.8.B | M1.3.B 75.48,45 75.82,45.34 75.82,51.82 77.34,53.34 | M1.2.B 82.53,49 83.57,50.04 | 84.84,53.34 83.57,52.07 83.57,50.04 | M1.1.B 80.79,42.02 81.81,42.02 83.57,43.78 83.57,50.04 | M1.0.B 88.22,42 87,43.22 87,48.01 88.01,49.02 89.21,49.02 M1.9.B 90.4,49 94.74,53.34
  Bottom 0.305: M1.3.B 73.32,45 72.01,43.69 72.01,39.24 | M1.5.B 73.27,23 72.01,24.26 72.01,39.24 | M1.4.B 73.25,38 72.01,39.24 | M1.8.B 94.91,45 93.85,43.94 93.85,38.86 | M1.6.B 94.76,23 93.85,23.9 93.85,38.86 | M1.7.B 94.72,38 93.85,38.86
M1.A
  Top 0.203: JP1.8 36.83,3.2 40.23,6.6 85.26,6.6 IC3.15
M1.B
  Top 0.203: JP1.9 34.29,3.43 37.89,7.04 83.16,7.04 IC3.14
M1.C
  Top 0.203: JP1.10 31.75,3.41 35.79,7.44 81.02,7.44 IC3.13
M1.D
  Top 0.203: JP1.11 34.06,7.85 79.22,7.85 81.73,10.36 IC3.12
M2.4
  Top 0.305: R8.1 67.5,49.85 72.01,54.36 107.06,54.36 | 107.06,54.36 114.05,54.36 | 114.05,54.36 124.59,54.36 | 124.59,54.36 124.97,54.36 127.25,52.07 127.25,46.35 125.9,45 M2.8.B | M2.2.B 111.1,49 112.14,50.04 | M2.1.B 110.96,42 112.14,43.18 112.14,50.04 | M2.3.B 103.31,45.09 104.27,45.09 105.03,45.85 105.03,52.32 107.06,54.36 | 114.05,54.36 112.14,52.45 112.14,50.04 | M2.9.B 118.25,49.02 119.25,49.02 124.59,54.36
  Bottom 0.305: M2.3.B 103.19,44.96 102.23,44.96 100.84,43.56 100.84,39.37 | M2.5.B 101.84,23 100.84,24 100.84,39.37 | M2.4.B 102.21,38 100.84,39.37 | M2.9.B 117.24,49 117.22,49.02 116.08,47.88 116.08,42.93 117,42 M2.0.B | M2.8.B 122.98,45 122.06,44.08 122.06,38.73 | M2.6.B 122.67,23 122.06,23.61 122.06,38.73 | M2.7.B 122.79,38 122.06,38.73
M2.A
  Top 0.203: JP1.4 46.99,3.71 48.21,4.93 113.89,4.93 118.35,9.38 IC4.15
M2.B
  Top 0.203: JP1.5 46.81,5.36 111.78,5.36 115.81,9.38 IC4.14
M2.C
  Top 0.203: JP1.6 41.94,3 44.7,5.77 109.65,5.77 113.27,9.38 IC4.13
M2.D
  Top 0.203: JP1.7 39.37,3.31 42.24,6.17 107.52,6.17 110.73,9.38 IC4.12
MINUTE1.A
  Top 0.203: SHIFT2-MINUTES.3 70.58,101.52 68.25,99.19 68.25,86.43 67.12,85.29 55.32,85.29 44.48,74.45 40.41,74.45 36.83,70.87 JP2.8
MINUTE1.B
  Top 0.203: SHIFT2-MINUTES.2 70.61,104.06 67.26,100.71 67.26,86.95 66.08,85.78 54.41,85.78 43.94,75.31 38.73,75.31 34.29,70.87 JP2.9
MINUTE1.C
  Top 0.203: SHIFT2-MINUTES.1 70.63,106.6 66.4,102.36 66.4,87.48 65.17,86.26 53.49,86.26 43.46,76.22 36.85,76.22 31.75,71.12 JP2.10
MINUTE1.D
  Top 0.203: SHIFT2-MINUTES.15 75.41,110.74 70.61,110.74 65.66,105.79 65.66,88.01 64.39,86.74 52.58,86.74 43.05,77.22 35.56,77.22 29.21,70.87 JP2.11
MINUTE2.A
  Top 0.203: SHIFT2-MINUTES.7 73.15,91.36 72.08,90.3 72.08,85.96 69.48,83.36 59.73,83.36 47.24,70.88 47.24,64.25 JP2.4
MINUTE2.B
  Top 0.203: SHIFT2-MINUTES.6 72.41,93.9 71.09,92.58 71.09,85.98 68.96,83.84 58.82,83.84 44.45,69.47 JP2.5
MINUTE2.C
  Top 0.203: SHIFT2-MINUTES.5 71.67,96.44 70.1,94.87 70.1,86.13 68.3,84.33 57.53,84.33 45.54,72.34 43.38,72.34 41.91,70.87 JP2.6
MINUTE2.D
  Top 0.203: SHIFT2-MINUTES.4 70.56,98.98 69.24,97.66 69.24,86.28 67.77,84.81 56.24,84.81 44.76,73.33 41.83,73.33 39.37,70.87 JP2.7
N$1
  Top 0.203: U$1.J1.4 33.78,114.52 32.92,113.67 23.37,113.67 21.08,115.95 17.02,115.95 5.97,104.9 5.97,93.69 4.45,92.17 ARDUINO_NANO1.8
N$2
  Top 0.203: U$1.J1.3 36.32,114.49 34.63,112.8 23.35,112.8 20.83,115.32 17.5,115.32 6.83,104.65 6.83,92 4.45,89.62 3.82,89.62 ARDUINO_NANO1.9
N$3
  Bottom 0.203: SHIFT2-MINUTES.14 81.74,101.52 80.39,102.87 80.39,109.98 77.85,112.52 55.44,112.52 54.86,113.09 23.6,113.09 20.48,109.98 19.08,109.98 ARDUINO_NANO1.30
N$4
  Bottom 0.203: SHIFT2-MINUTES.12 81.2,96.44 79.78,97.86 79.78,109.71 77.73,111.76 55.59,111.76 55.12,112.23 24.38,112.23 19.56,107.41 ARDUINO_NANO1.29
N$5
  Bottom 0.203: ARDUINO_NANO1.28 19.05,105.65 24.65,111.25 77.23,111.25 78.99,109.48 78.99,95.73 80.82,93.9 SHIFT2-MINUTES.11
N$6
  Bottom 0.203: ARDUINO_NANO1.22 19.08,89.66 44.7,89.66 51.02,83.34 71.95,83.34 72.93,82.18 ENC_A.1
N$7  (via drill 0.35)
  Top 0.203: v59.69,97.79 63.5,93.98 SHIFT1-HOURS.11
  Bottom 0.203: ARDUINO_NANO1.26 19.81,99.79 22.32,102.3 45.64,102.3 52.61,109.26 57.38,109.26 59.69,106.95 v59.69,97.79
N$8  (via drill 0.35)
  Top 0.203: SHIFT1-HOURS.12 58.93,101.01 v58.93,101.09
  Bottom 0.203: ARDUINO_NANO1.25 19.68,97.25 22.98,100.54 45.28,100.54 53.39,108.65 56.73,108.65 58.93,106.45 v58.93,101.09
N$9
  Top 0.305: 30.48,54.36 58.04,54.36 62.5,49.9 R5.1 | 30.48,54.36 26.67,54.36 | 26.67,54.36 15.49,54.36 | 15.49,54.36 9.91,54.36 7.75,52.2 7.75,46.74 6.01,45 H1.3.B | H1.2.B 12.8,49 13.59,49.78 | 13.59,49.78 13.59,52.45 15.49,54.36 | 26.67,54.36 21.31,49 H1.9.B 19.28,49 18.16,47.88 18.16,43.56 19.72,42 H1.0.B | H1.8.B 27.09,45 28.45,46.35 28.45,52.32 30.48,54.36 | 13.59,49.78 13.59,42.8 12.79,42 H1.1.B
  Bottom 0.305: H1.7.B 25.37,38 24.51,38.86 | H1.8.B 25.26,45 24.51,44.26 24.51,38.86 | H1.4.B 4.16,38 3.17,38.99 | H1.3.B 4.6,45 3.17,43.58 3.17,38.99 | H1.5.B 4.18,23 3.17,24 3.17,38.99 | H1.6.B 25.39,23 24.51,23.88 24.51,38.86
N$10
  Top 0.305: R6.1 60.96,25.89 60.96,48.26 | 60.96,48.26 60.96,49.78 57.4,53.34 54.86,53.34 | 54.86,53.34 46.48,53.34 | 46.48,53.34 38.23,53.34 36.58,51.69 36.58,46.35 35.22,45 H2.3.B | H2.2.B 42.14,49 43.31,50.16 | 43.31,50.16 46.48,53.34 | H2.1.B 40.79,42.02 42.19,42.02 43.31,43.14 43.31,50.16 | 54.86,53.34 50.52,49 H2.9.B 48.75,49 47.12,47.37 47.12,43.05 48.17,42 H2.0.B | H2.8.B 57.7,45 60.96,48.26
  Bottom 0.305: H2.3.B 32.68,45 31.5,43.81 31.5,37.21 | 31.5,37.21 32.28,38 H2.4.B | 31.5,37.21 31.5,24.13 31.86,23.76 H2.5.B | H2.7.B 54.96,38 53.72,39.24 | 53.72,39.24 53.72,44.07 54.65,45 H2.8.B | 53.72,39.24 53.72,24.13 54.85,23 H2.6.B
N$11
  Top 0.203: M2.1 119.09,39.75 M2.0.C
N$12
  Top 0.203: M2.2 120.9,31.5 120.9,44.94 M2.9.C
N$13
  Top 0.203: M2.3 120.29,27.8 121.93,29.45 121.93,45.47 122.84,46.39 M2.8.C
N$18
  Top 0.203: M2.4 121.25,25.37 125.86,29.98 125.86,38.56 125.04,39.39 M2.7.C
N$19
  Top 0.203: M2.0 107.57,34.85 107.57,42.29 108.67,43.39 M2.1.C
N$20
  Top 0.203: M2.9 106.55,32.05 106.55,48.64 108.3,50.39 M2.2.C
N$21
  Top 0.203: M2.8 106.94,27.8 105.41,29.34 105.41,41.43 M2.3.C
N$22
  Top 0.203: M2.7 106.59,25.37 104.39,27.56 104.39,35.45 M2.4.C
N$23
  Top 0.203: M2.5.C 110.14,21.61 M2.6
N$24
  Top 0.203: M2.5 116.47,23.99 117.22,23.24 121.92,23.24 123.07,24.39 M2.6.C
N$25
  Top 0.203: M1.5 86.98,23.5 92.08,23.5 93.09,24.51 95.65,24.51 M1.6.C
N$26
  Bottom 0.203: ARDUINO_NANO1.23 19.08,92.2 44.96,92.2 52.83,84.33 75.94,84.33 78.01,82.26 ENC_B.1
N$27
  Bottom 0.203: ENC_BTN.1 50.39,81.18 44.48,87.09 ARDUINO_NANO1.21
N$28
  Top 0.203: M1.1 90.09,39.75 M1.0.C
N$29
  Top 0.203: M1.2 91.82,31.42 91.82,45.02 M1.9.C
N$30
  Top 0.203: M1.3 91.42,27.8 92.96,29.35 92.96,44.7 94.65,46.39 M1.8.C
N$31
  Top 0.203: M1.4 91.92,25.37 93.73,27.18 93.73,38.1 95.02,39.39 M1.7.C
N$32
  Top 0.203: M1.0 78.87,34.55 78.87,42.29 79.97,43.39 M1.1.C
N$33
  Top 0.203: M1.9 77.72,31.88 77.72,48.39 79.73,50.39 M1.2.C
N$34
  Top 0.203: M1.3.C 75.82,42.02 75.82,29.34 77.35,27.8 M1.8
N$35
  Top 0.203: M1.7 77.5,25.37 74.23,28.64 M1.4.C
N$36
  Top 0.203: M1.5.C 81.14,21.61 M1.6
N$37
  Top 0.203: H2.0 38.61,34.81 38.61,42.42 39.58,43.39 H2.1.C
N$38
  Top 0.203: H2.2.C 39.7,50.39 37.47,48.15 37.47,32.13 H2.9
N$39
  Top 0.203: H2.8 36.07,30.95 36.07,41.77 H2.3.C
N$40
  Top 0.203: H2.1 50.09,39.75 H2.0.C
N$41
  Top 0.203: H2.2 52.2,31.8 52.2,45.59 50.18,47.61 H2.9.C
N$42
  Top 0.203: H2.3 53.21,30.23 53.21,44.96 54.65,46.39 H2.8.C
N$43
  Top 0.203: H2.4.C 34.23,28.25 37.12,25.37 H2.7
N$44
  Top 0.203: H2.5.C 41.9,22.37 H2.6
N$45
  Top 0.203: H2.4 52.29,25.37 53.98,27.05 53.98,38.48 54.88,39.39 H2.7.C
N$46
  Top 0.203: H2.5 48.02,23.99 48.53,23.48 53.72,23.48 54.63,24.39 H2.6.C
N$47
  Top 0.203: H1.1 21.97,34.39 21.97,39.75 21.11,40.61 H1.0.C
N$48
  Top 0.203: H1.9.C 21.73,47.61 23.11,46.23 23.11,31.71 H1.2
N$49
  Top 0.203: H1.8.C 25.43,46.39 24.64,45.59 24.64,30.66 H1.3
N$50
  Top 0.203: H1.7.C 27.29,39.39 28.07,38.61 28.07,29.21 24.22,25.37 H1.4
N$51
  Top 0.203: H1.5 18.12,23.35 23.45,23.35 24.49,24.39 H1.6.C
N$52
  Top 0.203: H1.1.C 10.75,43.39 9.65,42.29 9.65,34.77 H1.0
N$53
  Top 0.203: H1.2.C 10.26,50.39 8.64,48.77 8.64,31.96 H1.9
N$54
  Top 0.203: H1.3.C 7.24,41.6 7.24,30.78 H1.8
N$55
  Top 0.203: H1.4.C 5.23,28.04 7.91,25.37 H1.7
N$56
  Top 0.203: H1.5.C 12.14,21.61 H1.6
N$57
  Bottom 0.203: IC4.2 118.35,20.61 120.12,22.38 120.12,25.43 117.33,28.21 117.33,33.82 120.9,37.39 120.9,41.91 119.42,43.39 M2.0.E
N$58
  Bottom 0.203: IC4.3 115.81,20.84 114.05,22.61 114.05,33.27 115.44,34.67 115.44,48.77 117.06,50.39 M2.9.E
N$59  (via drill 0.35)
  Top 0.203: v123.06,15.75 127.13,19.81 127.13,41.51 125.02,43.61 M2.8.E
  Bottom 0.203: IC4.4 113.27,17.04 114.56,15.75 v123.06,15.75
N$60
  Bottom 0.203: IC4.5 110.73,17.04 113.04,14.73 123.7,14.73 125.48,16.51 125.48,35.9 124.77,36.61 M2.7.E
N$61
  Top 0.203: IC4.6 108.19,17.04 111.89,13.34 118.75,13.34 123.77,18.36 M2.6.E
N$62
  Bottom 0.203: IC4.7 105.65,23 104.26,24.39 M2.5.E
N$63
  Top 0.203: U$1.J1.2 38.86,114.37 36.31,111.81 23.44,111.81 20.57,114.68 18.03,114.68 16.54,113.18 16.54,87.06 ARDUINO_NANO1.20
N$64  (via drill 0.35)
  Top 0.203: v101.22,10.67 101.22,38.35 102.25,39.39 M2.4.E
  Bottom 0.203: IC4.9 103.09,10.67 v101.22,10.67
N$65  (via drill 0.35)
  Top 0.203: v99.82,10.67 99.82,44.7 101.51,46.39 M2.3.E
  Bottom 0.203: IC4.10 105.65,9.67 104.74,8.76 101.47,8.76 99.82,10.41 v99.82,10.67
N$66  (via drill 0.35)
  Top 0.203: v98.42,10.67 98.42,13.46 98.68,13.72 98.68,45.97 v101.22,48.51
  Bottom 0.203: IC4.11 108.19,9.77 106.43,8 100.84,8 98.42,10.41 v98.42,10.67 | v101.22,48.51 104.65,48.51 105.55,47.61 M2.2.E
N$67
  Top 0.203: IC4.1 120.89,19.33 119.39,20.83 115.82,20.83 114.05,22.61 114.05,33.18 112.57,34.65 112.57,37.81 M2.1.E
N$68
  Top 0.203: IC3.6 84.04,13.46 91.31,13.46 95.77,17.92 M1.6.E
N$69
  Top 0.203: IC1.6 10.19,16.86 12.45,14.61 23.37,14.61 26.27,17.51 H1.6.E
N$70
  Top 0.203: IC2.6 39.09,17.3 42.04,14.35 52.45,14.35 55.77,17.67 H2.6.E
N$71
  Bottom 1.27: M2.A R1.1
N$72
  Bottom 1.27: M1.A R2.1
N$73
  Bottom 1.27: H2.A R3.1
N$74
  Bottom 1.27: R4.1 H1.A
N$75
  Bottom 0.203: IC3.2 89.35,21.38 90.99,23.02 90.99,25.56 88.46,28.09 88.46,33.98 91.19,36.7 91.19,42.04 89.83,43.39 M1.0.E
N$76
  Bottom 0.203: IC3.3 86.81,21.08 85.03,22.86 85.03,33.63 86.43,35.03 86.43,37.66 87.5,38.73 87.5,49.78 88.11,50.39 M1.9.E
N$77  (via drill 0.35)
  Top 0.203: v96.27,17.14 97.54,18.41 97.54,42.29 96.22,43.61 M1.8.E
  Bottom 0.203: IC3.4 86.83,15.75 94.87,15.75 v96.27,17.14
N$78
  Bottom 0.203: IC3.5 85.18,14.86 95.76,14.86 97.92,17.02 97.92,34.46 M1.7.E
N$79
  Bottom 0.203: IC3.7 76.65,22.66 74.92,24.39 M1.5.E
N$80  (via drill 0.35)
  Top 0.203: M1.4.E 73.3,39.39 72.26,38.35 v72.26,10.79
  Bottom 0.203: IC3.9 72.37,10.69 v72.26,10.79
N$81  (via drill 0.35)
  Top 0.203: v71.25,10.79 71.25,45.09 72.55,46.39 M1.3.E
  Bottom 0.203: IC3.10 76.65,9.67 75.74,8.76 72.77,8.76 71.25,10.29 v71.25,10.79
N$82  (via drill 0.35)
  Top 0.203: v70.23,10.79 70.23,46.35 v72.26,48.39
  Bottom 0.203: IC3.11 79.19,9.67 77.52,8 72.26,8 70.23,10.03 v70.23,10.79 | v72.26,48.39 76.33,48.39 77.1,47.61 M1.2.E
N$83
  Top 0.203: IC3.1 91.89,19.45 89.75,21.59 86.36,21.59 85.03,22.93 85.03,33.7 83.57,35.16 83.57,37.81 M1.1.E
N$84
  Bottom 0.203: IC2.2 49.25,22.04 50.99,23.78 50.99,25.56 47.83,28.72 47.83,33.35 51.31,36.83 51.31,42.42 50.34,43.39 H2.0.E
N$85
  Bottom 0.203: IC2.3 46.71,21.36 44.96,23.11 44.96,33.18 46.43,34.65 46.43,38.43 46.99,38.99 46.99,49.22 48.16,50.39 H2.9.E
N$86  (via drill 0.35)
  Top 0.203: v55.24,15.37 58.17,18.29 58.17,41.21 H2.8.E
  Bottom 0.203: IC2.4 44.17,16.66 45.47,15.37 v55.24,15.37
N$87
  Bottom 0.203: IC2.5 41.63,16.54 44.45,13.72 55.5,13.72 58.17,16.38 58.17,34.21 H2.7.E
N$88
  Bottom 0.203: IC2.7 36.55,23.65 35.05,25.15 H2.5.E
N$89  (via drill 0.35)
  Top 0.203: H2.4.E 33.29,39.39 31.88,37.98 v31.88,10.41
  Bottom 0.203: IC2.9 33.15,10.41 v31.88,10.41
N$90  (via drill 0.35)
  Top 0.203: v30.86,10.41 30.86,44.45 32.8,46.39 H2.3.E
  Bottom 0.203: v30.86,10.41 32.77,8.51 35.74,8.51 36.55,9.32 IC2.10
N$91  (via drill 0.35)
  Top 0.203: v29.84,10.41 29.84,46.74 v31.24,48.13
  Bottom 0.203: IC2.11 39.09,9.24 37.85,8 32.26,8 v29.84,10.41 | v31.24,48.13 35.94,48.13 36.46,47.61 H2.2.E
N$92
  Top 0.203: IC2.1 51.79,19.55 49.75,21.59 46.48,21.59 44.96,23.11 44.96,33.14 43.57,34.53 43.57,37.81 H2.1.E
N$93
  Bottom 0.203: IC1.2 20.35,21.63 22.25,23.53 22.25,25.3 19.27,28.28 19.27,33.75 22.47,36.96 22.47,42.22 21.3,43.39 H1.0.E
N$94
  Bottom 0.203: IC1.3 17.81,20.6 16,22.4 16,33.12 17.42,34.54 17.42,48.67 19.15,50.39 H1.9.E
N$95  (via drill 0.35)
  Top 0.203: v28.19,19.3 28.96,20.07 28.96,40.92 H1.8.E
  Bottom 0.203: IC1.4 15.27,17.09 16.51,15.85 24.74,15.85 v28.19,19.3
N$96
  Bottom 0.203: IC1.5 12.73,16.99 14.73,14.99 25.15,14.99 29.34,19.18 29.34,33.54 H1.7.E
N$97
  Bottom 0.203: IC1.7 7.65,22.7 5.96,24.39 H1.5.E
N$98
  Top 0.203: IC1.9 5.11,9.43 4.83,9.14 3.68,9.14 2.92,9.91 2.92,38.1 4.21,39.39 H1.4.E
N$99
  Top 0.203: H1.3.E 4.03,46.39 2.16,44.52 2.16,9.27 3.7,7.72 5.84,7.72 7.65,9.53 IC1.10
N$100  (via drill 0.35)
  Top 0.203: IC1.11 10.19,8.67 8.64,7.11 3.43,7.11 1.39,9.15 1.39,45.85 3.68,48.13 v3.94,48.13
  Bottom 0.203: H1.2.E 10.5,47.61 9.98,48.13 v3.94,48.13
N$101
  Top 0.203: IC1.1 22.89,19.33 21.13,21.08 17.53,21.08 16,22.61 16,33.19 14.56,34.63 14.56,37.82 H1.1.E
PP5  (via drill 0.35)
  Top 0.203: SHIFT2-MINUTES.10 85.09,94.36 85.09,112.01
  Top 1.27: 58.09,112.01 55.12,112.01 47.78,119.35 31.24,119.35 | 58.09,112.01 76.68,112.01 | 76.68,112.01 85.09,112.01 86.36,112.01 94.11,104.27 94.11,79.5 86.74,72.14 57.91,72.14 52.07,66.29 JP2.2 | ARDUINO_NANO1.12 7.24,82.01 10.67,85.44 v10.67,95.5 | v10.67,114.94 10.67,116.2 13.81,119.35 31.24,119.35 | U$1.J1.5 31.24,119.35 | SHIFT1-HOURS.16 v61.17,108.93 58.09,112.01 | SHIFT2-MINUTES.16 76.68,112.01
  Bottom 0.203: SHIFT1-HOURS.10 61.52,93.34 61.52,108.58 v61.17,108.93
  Bottom 1.27: v10.67,114.94 v10.67,95.5
PP5(2)
  Bottom 0.635: JP1.2 52.07,5.71 | 52.07,5.71 52.07,10.99 IC2.16 | 52.07,5.71 50.8,6.99 26.59,6.99 IC1.16 | 52.07,5.71 52.2,5.84 60.07,5.84 | 60.07,5.84 62.36,5.84 | 62.36,5.84 64.39,5.84 | 64.39,5.84 88.39,5.84 | 88.39,5.84 91.89,9.34 IC3.16 | R6.2 62.5,8.27 60.07,5.84 | R7.2 67.5,8.95 64.39,5.84 | 62.36,5.84 65.02,8.51 65.02,25.13 | 65.02,25.13 R5.2 | R8.2 67.5,27.6 65.02,25.13 | IC4.16 120.9,10.68 120.9,9.53 117.22,5.84 88.39,5.84
PP12
  Bottom 1.27: ARDUINO_NANO1.15 4.83,74.39 8.51,78.07 8.51,115.57 10.29,117.35 50.29,117.35 52.13,115.51 67.29,115.51 PP12.1 112.08,114.75 118.39,108.43 U$4.VIN
PP170
  Bottom 2.54: U$4.HV 104.94,64 JP2.1
PP170(2)
  Bottom 1.27: JP1.1 120.36,3 128.16,10.79 128.16,51.03 121.28,57.9 114.06,57.9 R1.2 R2.2 R3.2 R4.2
SERIAL-IN  (via drill 0.35)
  Top 0.203: v60.45,103.38 62.31,101.52 SHIFT1-HOURS.14
  Bottom 0.203: ARDUINO_NANO1.27 19.68,102.33 21.28,103.92 45.37,103.92 51.31,109.87 58.02,109.87 60.45,107.44 v60.45,103.38

### Text on the board
tPlace: Page & Squire